# Altium schematic sheet periph.SchDoc
size A4
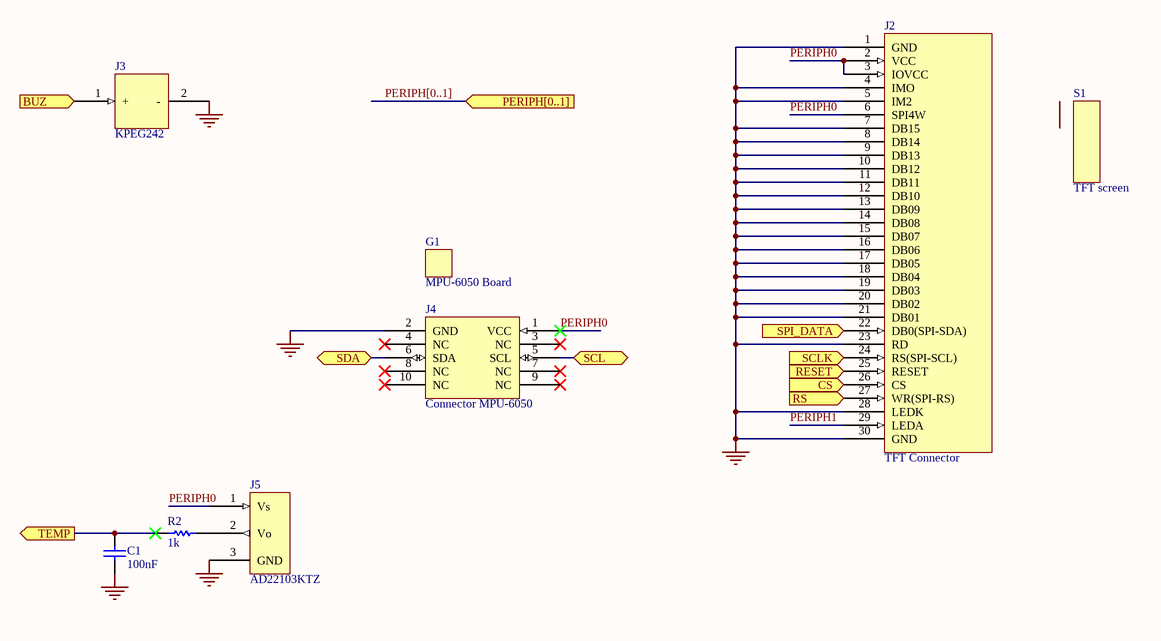
[diagram p0: periph.SchDoc]

## Parts
C1  100nF  [CAPACITOR]
G1  MPU-6050 Board  (mechanical)
J2  TFT Connector  [SCREEN]
J3  KPEG242  [BUZZER]
J4  Connector MPU-6050  [GYROSCOPE]
J5  AD22103KTZ  [TEMP]
R2  1k  [Resistor]
S1  TFT screen  (mechanical)

## Ports
BUZ (in), CS (in), PERIPH[0..1] (in), RESET (in), RS (in), SCL (bidir), SCLK (in), SDA (bidir), SPI_DATA (in), TEMP (out)

## Nets
GND: C1.1 J2.1(GND) J2.4(IMO) J2.5(IM2) J2.7(DB15) J2.8(DB14) J2.9(DB13) J2.10(DB12) J2.11(DB11) J2.12(DB10) J2.13(DB09) J2.14(DB08) J2.15(DB07) J2.16(DB06) J2.17(DB05) J2.18(DB04) J2.19(DB03) J2.20(DB02) J2.21(DB01) J2.23(RD) J2.28(LEDK) J2.30(GND) J3.2(-) J4.2(GND) J5.3(GND)
BUZ: J3.1(+) ; port BUZ
CS: J2.26(CS) ; port CS
PERIPH0: J2.2(VCC) J2.3(IOVCC) J2.6(SPI4W) J4.1(VCC) J5.1(Vs)
PERIPH1: J2.29(LEDA)
RESET: J2.25(RESET) ; port RESET
RS: J2.27(WR(SPI-RS)) ; port RS
SCL: J4.5(SCL) ; port SCL
SCLK: J2.24(RS(SPI-SCL)) ; port SCLK
SDA: J4.6(SDA) ; port SDA
SPI_DATA: J2.22(DB0(SPI-SDA)) ; port SPI_DATA
TEMP: C1.2 R2.2 ; port TEMP
NetJ5_2: J5.2(Vo) R2.1

Not connected (* = marked no-connect by the designer): J4 3(NC)* 4(NC)* 7(NC)* 8(NC)* 9(NC)* 10(NC)*

## Buses and harness runs
bus PERIPH[0..1] = port PERIPH[0..1]

## Library data of the parts
C1 = Cap: Capacitor; Published: 8-Jun-2000; LatestRevisionDate: 17-Jul-2002; LatestRevisionNote: Re-released for DXP Platform.; PackageReference: RAD-0.3; Publisher: Altium Limited; PackageDescription: Radial Cap, Thru-Hole; 2 Leads; 0.3 in Pin Spacing; Value: 100nF
G1 = MPU-6050: Fabricant: InvenSense; Fournisseur: Olimex; Ref. Fournisseur: MOD-MPU6050; Ref. Fabricant: MPU-6050
J2 = MCT0144C6W128128PML: Fabricant: OMRON ELECTRONIC COMPONENTS; Ref. Fabricant: XF2M30151A; Fournisseur: Farnell; Ref. Fournisseur: 1112560
J3 = KPEG242: Buzzer; Fabricant: KINGSTATE; Fournisseur: Farnell; Ref. Fournisseur: 1502726; Ref. Fabricant: KPEG242
J4 = Connector MPU-6050: Fabricant: WURTH ELEKTRONIK; Fournisseur: Farnell; Ref. Fabricant: 61301021021; Ref. Fournisseur: 1841231
J5 = AD22103KTZ: Temp sensor; Fabricant: Analog Devices; Fournisseur: Farnell; Ref. Fournisseur: 1438415; Ref. Fabricant: AD22103KTZ
R2 = Res1: Resistor; Published: 8-Jun-2000; LatestRevisionDate: 17-Jul-2002; LatestRevisionNote: Re-released for DXP Platform.; PackageReference: AXIAL-0.3; Publisher: Altium Limited; PackageDescription: Axial Device, Thru-Hole; 2 Leads; 0.3 in Pin Spacing; Value: 1k
S1 = Connector display: Fabricant: MIDAS; Fournisseur: Farnell; Ref. Fabricant: MCT0144C6W128128PML; Ref. Fournisseur: 2606862